# Altium schematic sheet DAC8554.SchDoc: FIT_PM12 board
size 420 x 297 mm; CheckedBy: G.Kasprowicz; Author: INR Moscow; CompanyName: WUT ISE; DrawnBy: M.Podgórski; Organization: WUT ISE; Address1: PW ISE; Address2: Nowowiejska 15/19 00-665 Warsaw; Address3: gkasprow@gmail.com; DocumentNumber: 8; Revision: 2; SheetNumber: 11; SheetTotal: 34; ModifiedBy: -; CheckedDate: -; Title2: DACs; DivGrp: WUT ISE; Designer: INR RAS; ModifiedDate: -; ProjectName: Sensor Box
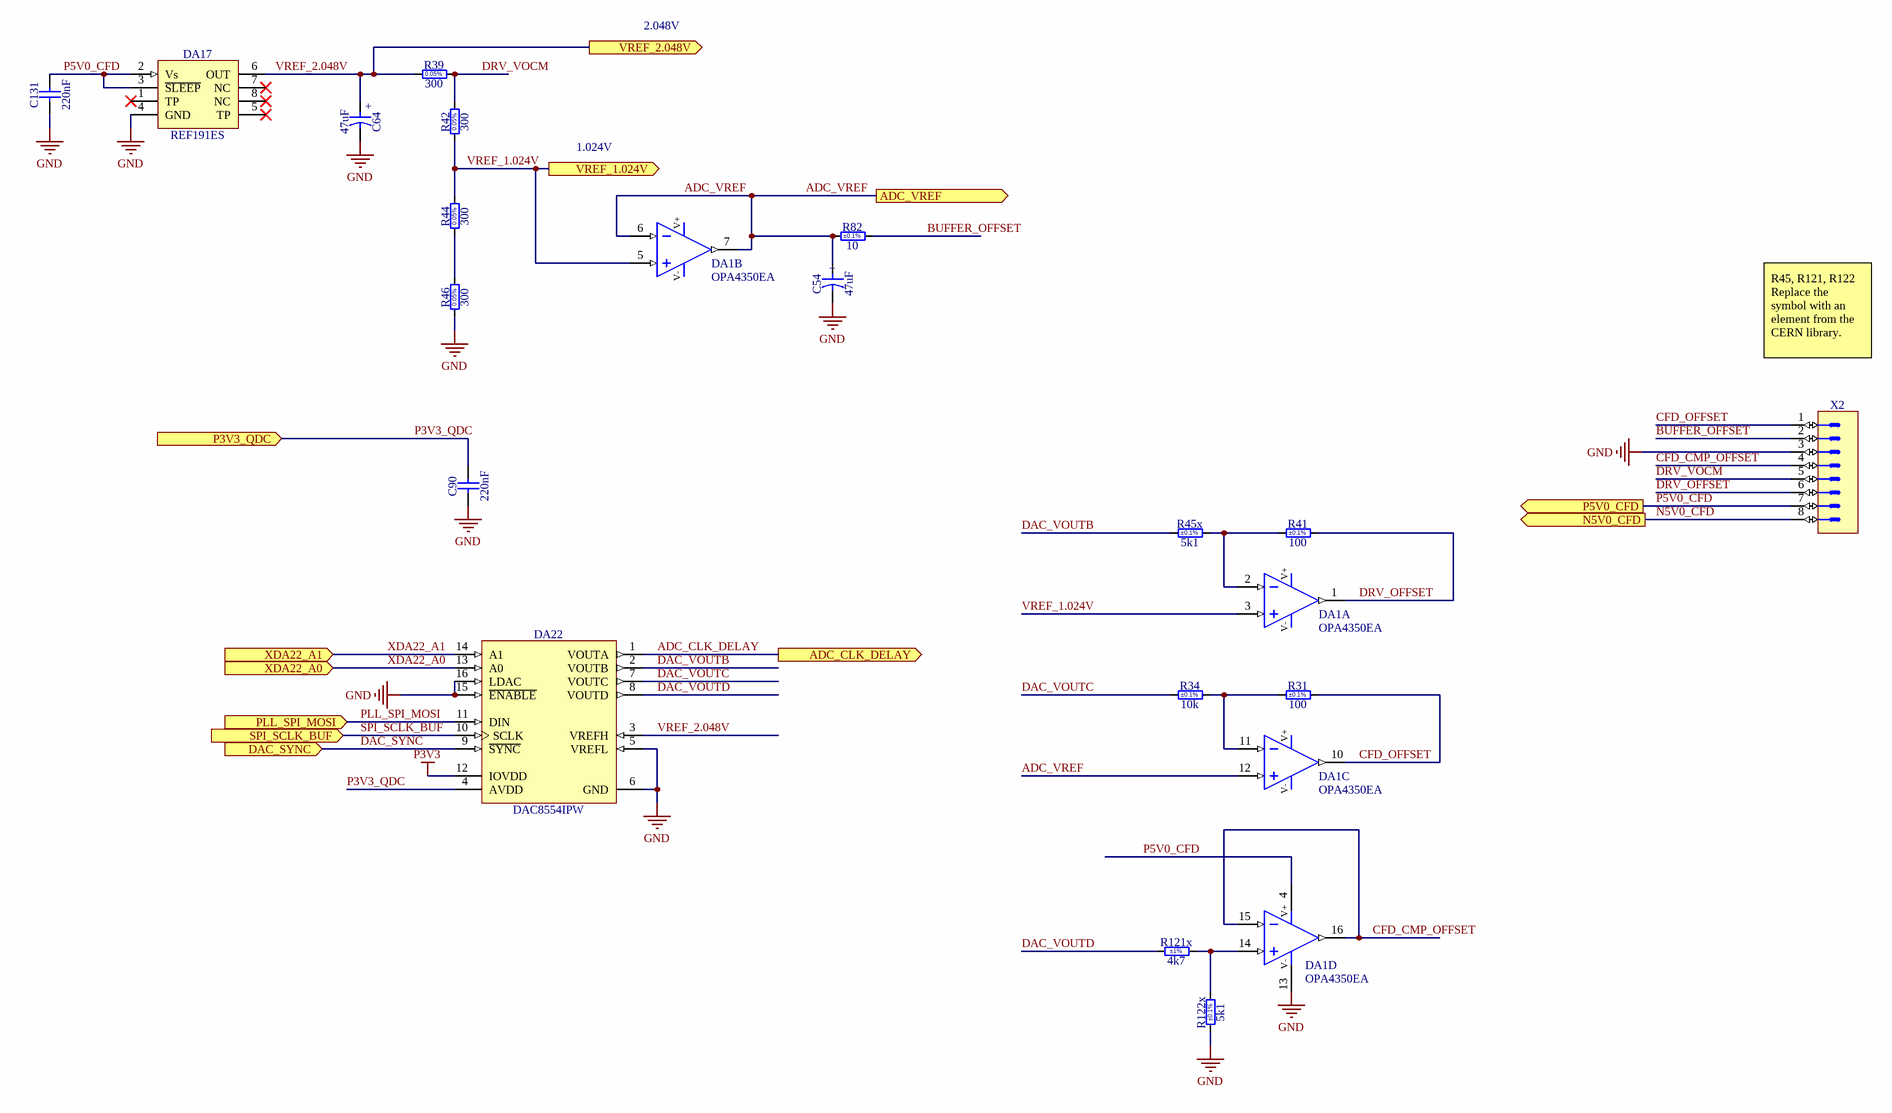
[diagram p0: DAC8554.SchDoc]

## Parts
C54  47uF  [CAPMP3528X120N]
C64  47uF  [CAPMP3528X120N]
C90  220nF  [CAPC2012X135N]
C131  220nF  [CAPC2012X135N]
DA1  OPA4350EA  [SOP63P600X175-16N]  (parts A,B,C,D of 4)
DA17  REF191ES  [SOIC127P600X175-8N]
DA22  DAC8554IPW  [SOP65P640X110-16N]
R31  100  Tolerance: ±0.1%  [RESC2012X60N]
R34  10k  Tolerance: ±0.1%  [RESC2012X60N]
R39  300  [RESC2012X60N]
R41  100  Tolerance: ±0.1%  [RESC2012X60N]
R42  300  [RESC2012X60N]
R44  300  [RESC2012X60N]
R45x  5k1  Tolerance: ±0.1%  [RESC2012X60N]
R46  300  [RESC2012X60N]
R82  10  Tolerance: ±0.1%  [RESC2012X60N]
R121x  4k7  Tolerance: ±1%  [RESC2012X60N]
R122x  5k1  Tolerance: ±0.1%  [RESC2012X60N]
X2  Header 8  [SAMTEC_DW-08-09-L-S-470]  (value not drawn)

## Ports
ADC_CLK_DELAY (out), ADC_VREF (out), DAC_SYNC (in), N5V0_CFD (out), P3V3_QDC (in), P5V0_CFD (out), PLL_SPI_MOSI (in), SPI_SCLK_BUF (in), VREF_1.024V (out), VREF_2.048V (out), XDA22_A0 (in), XDA22_A1 (in)

## Nets
GND: C54.2 C64.2 C90.1 C131.1 DA1.13(V-) DA17.4(GND) DA22.5(VREFL) DA22.6(GND) DA22.15(~{ENABLE}) DA22.16(LDAC) R46.1 R122x.1 X2.3
P3V3: DA22.12(IOVDD)
ADC_CLK_DELAY: DA22.1(VOUTA) ; port ADC_CLK_DELAY
ADC_VREF: C54.1 DA1.6(IN-) DA1.7(OUT) DA1.12(IN+) R82.2 ; port ADC_VREF
BUFFER_OFFSET: R82.1 X2.2
CFD_CMP_OFFSET: DA1.15(IN-) DA1.16(OUT) X2.4
CFD_OFFSET: DA1.10(OUT) R31.2 X2.1
DAC_SYNC: DA22.9(~{SYNC}) ; port DAC_SYNC
DAC_VOUTB: DA22.2(VOUTB) R45x.1
DAC_VOUTC: DA22.7(VOUTC) R34.1
DAC_VOUTD: DA22.8(VOUTD) R121x.1
DRV_OFFSET: DA1.1(OUT) R41.2 X2.6
DRV_VOCM: R39.2 R42.2 X2.5
N5V0_CFD: X2.8 ; port N5V0_CFD
P3V3_QDC: C90.2 DA22.4(AVDD) ; port P3V3_QDC
P5V0_CFD: C131.2 DA1.4(V+) DA17.2(Vs) DA17.3(~{SLEEP}) X2.7 ; port P5V0_CFD
PLL_SPI_MOSI: DA22.11(DIN) ; port PLL_SPI_MOSI
SPI_SCLK_BUF: DA22.10(SCLK) ; port SPI_SCLK_BUF
VREF_1.024V: DA1.3(IN+) DA1.5(IN+) R42.1 R44.2 ; port VREF_1.024V
VREF_2.048V: C64.1 DA17.6(OUT) DA22.3(VREFH) R39.1 ; port VREF_2.048V
XDA22_A0: DA22.13(A0) ; port XDA22_A0
XDA22_A1: DA22.14(A1) ; port XDA22_A1
NetDA1_2: DA1.2(IN-) R41.1 R45x.2
NetDA1_11: DA1.11(IN-) R31.1 R34.2
NetDA1_14: DA1.14(IN+) R121x.2 R122x.2
NetR44_1: R44.1 R46.2

Not connected (* = marked no-connect by the designer): DA17 1(TP)* 5(TP)* 7(NC)* 8(NC)*

## Notes on the sheet
- 2.048V
- 1.024V
- R45, R121, R122 Replace the symbol with an element from the CERN library.
- Project/Equipment
- Document
- Designer
- Drawn by
- Check.by
- Copyright WUT ISE 2024.
  This documentation describes Open Hardware and is licensed under the CERN OHL v.2. You may redistribute and modify this documentation under the terms of the CERN OHL v.2. (http://ohwr.org/CERNOHL). This documentation is distributed WITHOUT ANY EXPRESS OR IMPLIED WARRANTY, INCLUDING OF MERCHANTABILITY, SATISFACTORY QUALITY AND FITNESS FOR A PARTICULAR PURPOSE. Please see the CERN OHL v.2 for applicable conditions.
- Contact
- File
- Last Mod.
- Print Date
- Sheet
- Size
- A3
- of
- Rev
- (in symbol CTE3528-12_47UF_10V_20%_PANASONIC_TPG) +
- (in symbol R0805_300R_0.05%_0.125W_10PPM) 0.05%

## Library data of the parts
C54 C64 = CTE3528-12_47UF_10V_20%_PANASONIC_TPG: Polarised capacitor; Part Description: ESR 0R07 Solid Tantalum Chip Capacitor; Manufacturer Part Number: 10TPG47M; Voltage: 10V; Tolerance: ±20%; Part Number: CTE3528-12_47UF_10V_20%_PANASONIC_TPG; Component Kind: Standard; Component Type: Standard; Pin Count: 2; Value: 47uF; Status: None; Manufacturer: PANASONIC; Case: T; Mounted: Yes; Socket: No; SMD: Yes; Sense: No; ComponentHeight: 1.2mm; HelpURL: \\cern.ch\dfs\Applications\Altium\Datasheets\CTE_PANASONIC_TPG.pdf; Author: CERN DEM JLC; CreateDate: 01.09.2014; LatestRevisionDate: 01.09.2014
C90 C131 = CC0805_220NF_50V_10%_X7R: Non-polarised capacitor; Part Description: SMD Multilayer Chip Ceramic Capacitor; Manufacturer: GENERIC; Manufacturer1 Part Number: GRM21BR71H224KA01L; Voltage: 50V; TC: X7R; Tolerance: ±10%; Part Number: CC0805_220NF_50V_10%_X7R; Component Kind: Standard; Component Type: Standard; Pin Count: 2; Value: 220nF; Status: Preferred; Manufacturer Part Number: CC0805_220NF_50V_10%_X7R; Case: 0805; Mounted: Yes; Socket: No; SMD: Yes; Sense: No; Manufacturer1 Example: MURATA; Manufacturer1 ComponentHeight: 1.35mm; HelpURL: \\cern.ch\dfs\Applications\Altium\Datasheets\CC0805_X7R_MURATA.pdf; Author: CERN DEM JLC; CreateDate: 03.12.2007; LatestRevisionDate: 03.12.2007
DA1 = OPA4350EA: Quad Operational Amplifier; Part Description: Quad, High-Speed, Single-Supply, Rail-to-Rail Operational Amplifiers MicroAmplifier Series; Manufacturer: TEXAS INSTRUMENTS; PressFit: No; Bonding: No; Part Number: OPA4350EA; Component Kind: Standard; Component Type: Standard; Device: OPA4350EA; PackageDescription: SOP, 0.635mm Pitch; 16 Pin, 3.9mm W X 4.895mm L X 1.75mm H body, IPC Medium Density; Manufacturer Part Number: OPA4350EA; Pin Count: 16; Case: SSOP16; Mounted: Yes; Socket: No; SMD: Yes; Sense: No; ComponentHeight: 1.75mm; Author: CERN DEM HF; HelpURL: \\cern.ch\dfs\Applications\Altium\Datasheets\OPA4350EA.pdf; CreateDate: 08.05.2024; LatestRevisionDate: 08.05.2024
DA17 = REF191ES: Precision Micropower, Low Dropout Voltage Reference; Part Description: 2.048V Precision Micropower, Low Dropout Voltage Reference, 5ppm/°C, −40°C to +85°C; Manufacturer: ANALOG DEVICES; PressFit: No; Bonding: No; Part Number: REF191ES; Component Kind: Standard; Component Type: Standard; Device: REF191ES; PackageDescription: SOIC 8, Pitch 1.27mm, Body 4x5mm, IPC Medium Density; Manufacturer Part Number: REF191ES; Pin Count: 8; Case: SOIC8; Mounted: Yes; Socket: No; SMD: Yes; Sense: No; ComponentHeight: 1.75mm; HelpURL: \\cern.ch\dfs\Applications\Altium\Datasheets\REF19x_Series.pdf; Author: CERN DEM HF; CreateDate: 17.05.2024; LatestRevisionDate: 17.05.2024
DA22 = DAC8554IPW: 16-Bit, Quad-Channel, Uultra-Low Glitch, Voltage Output Digital-to-Analog Converter; Manufacturer: TEXAS INSTRUMENTS; PressFit: No; Bonding: No; Part Number: DAC8554IPW; Component Kind: Standard; Component Type: Standard; Device: DAC8554IPW; PackageDescription: SOP, 0.65mm Pitch; 16 Pin, 4.40mm W X 5.00mm L X 1.10mm H body, IPC Medium Density; Part Description: 16-Bit, Quad-Channel, Uultra-Low Glitch, Voltage Output Digital-to-Analog Converter; Manufacturer Part Number: DAC8554IPW; Pin Count: 16; Case: TSSOP16; Mounted: Yes; Socket: No; SMD: Yes; Sense: No; ComponentHeight: 1.1mm; Author: CERN DEM HF; HelpURL: \\cern.ch\dfs\Applications\Altium\Datasheets\DAC8554.pdf; CreateDate: 07.05.2024; LatestRevisionDate: 07.05.2024
R31 R41 = R0805_100R_0.1%_0.1W_10PPM: Resistor - 0.1%; Part Description: Thin Film Chip Resistor; Manufacturer: GENERIC; Manufacturer1 Part Number: RN73C2A100RBTG; Power: 0.1W; TC: ±10ppm; PressFit: No; Part Number: R0805_100R_0.1%_0.1W_10PPM; Component Kind: Standard; Component Type: Standard; Pin Count: 2; Value: 100; Status: Not Recommended; Manufacturer Part Number: R0805_100R_0.1%_0.1W_10PPM; Case: 0805; Mounted: Yes; Sense: No; Socket: No; SMD: Yes; Manufacturer1 Example: TYCO HOLSWORTHY; Manufacturer1 ComponentHeight: 0.6mm; HelpURL: \\cern.ch\dfs\Applications\Altium\Datasheets\R0805_Tyco_RN73.pdf; Author: CERN DEM JLC; CreateDate: 03.12.2007; LatestRevisionDate: 13.03.2008
R34 = R0805_10K_0.1%_0.1W_10PPM: Resistor - 0.1%; Part Description: Thin Film Chip Resistor; Manufacturer: GENERIC; Manufacturer1 Part Number: RN73C2A10KBTG; Power: 0.1W; TC: ±10ppm; PressFit: No; Part Number: R0805_10K_0.1%_0.1W_10PPM; Component Kind: Standard; Component Type: Standard; Pin Count: 2; Value: 10k; Status: Not Recommended; Manufacturer Part Number: R0805_10K_0.1%_0.1W_10PPM; Case: 0805; Mounted: Yes; Sense: No; Socket: No; SMD: Yes; Manufacturer1 Example: TYCO HOLSWORTHY; Manufacturer1 ComponentHeight: 0.6mm; HelpURL: \\cern.ch\dfs\Applications\Altium\Datasheets\R0805_Tyco_RN73.pdf; Author: CERN DEM JLC; CreateDate: 03.12.2007; LatestRevisionDate: 13.03.2008
R39 R42 R44 R46 = R0805_300R_0.05%_0.125W_10PPM: Resistor - 0.05%; Part Description: Thin Film Chip Resistor; Manufacturer: GENERIC; Manufacturer1 Part Number: RG2012N-301-W; Power: 0.125W; TC: ±10ppm/°C; PressFit: No; Part Number: R0805_300R_0.05%_0.125W_10PPM; Component Kind: Standard; Component Type: Standard; Pin Count: 2; Value: 300; Status: Not Recommended; Tolerance: ±0.05%; Manufacturer Part Number: R0805_300R_0.05%_0.125W_10PPM; Case: 0805; Mounted: Yes; Sense: No; Socket: No; SMD: Yes; Manufacturer1 Example: SUSUMU; Manufacturer1 ComponentHeight: 0.5mm; HelpURL: \\cern.ch\dfs\Applications\Altium\Datasheets\R0805_SUSUMU_RG.pdf; Author: CERN DEM HF; CreateDate: 24.06.2024; LatestRevisionDate: 24.06.2024
R45x R122x = R0805_5K1_0.1%_0.1W_25PPM: Resistor - 0.1%; Part Description: Precision Surface Mount Resistor; Manufacturer: GENERIC; Manufacturer1 Part Number: PCF0805R-5K1BT1; Power: 0.1W; TC: ±25ppm/°C; PressFit: No; Part Number: R0805_5K1_0.1%_0.1W_25PPM; Component Kind: Standard; Component Type: Standard; Pin Count: 2; Value: 5k1; Status: Not Recommended; Manufacturer Part Number: R0805_5K1_0.1%_0.1W_25PPM; Case: 0805; Mounted: Yes; Sense: No; Socket: No; SMD: Yes; Manufacturer1 Example: TT ELECTRONICS; Manufacturer1 ComponentHeight: 0.5mm; HelpURL: \\cern.ch\dfs\Applications\Altium\Datasheets\R0805_TT ELECTRONICS_PCF.pdf; Author: CERN DEM JLC; CreateDate: 03.11.2010; LatestRevisionDate: 25.10.2018
R82 = R0805_10R_0.1%_0.1W_10PPM: Resistor - 0.1%; Part Description: Thin Film Chip Resistor; Manufacturer: GENERIC; Manufacturer1 Part Number: RN73C2A10RBTG; Power: 0.1W; TC: ±10ppm; PressFit: No; Part Number: R0805_10R_0.1%_0.1W_10PPM; Component Kind: Standard; Component Type: Standard; Pin Count: 2; Value: 10; Status: Not Recommended; Manufacturer Part Number: R0805_10R_0.1%_0.1W_10PPM; Case: 0805; Mounted: Yes; Sense: No; Socket: No; SMD: Yes; Manufacturer1 Example: TYCO HOLSWORTHY; Manufacturer1 ComponentHeight: 0.6mm; HelpURL: \\cern.ch\dfs\Applications\Altium\Datasheets\R0805_Tyco_RN73.pdf; Author: CERN DEM JLC; CreateDate: 03.12.2007; LatestRevisionDate: 13.03.2008
R121x = R0805_4K7_1%_0.125W_100PPM: Resistor - 1%; Part Description: General Purpose Thick Film Chip Resistor; Manufacturer: GENERIC; Manufacturer1 Part Number: NRC10F4701TRF; Power: 0.125W; TC: ±100ppm/°C; PressFit: No; Part Number: R0805_4K7_1%_0.125W_100PPM; Component Kind: Standard; Component Type: Standard; Pin Count: 2; Value: 4k7; Status: Preferred; Manufacturer Part Number: R0805_4K7_1%_0.125W_100PPM; Case: 0805; Mounted: Yes; Sense: No; Socket: No; SMD: Yes; Manufacturer1 Example: NIC COMPONENT; Manufacturer1 ComponentHeight: 0.6mm; HelpURL: \\cern.ch\dfs\Applications\Altium\Datasheets\R0805_NIC_NRC.pdf; Author: CERN DEM JLC; CreateDate: 03.12.2007; LatestRevisionDate: 13.03.2008
X2 = SAMTEC_DW-08-09-L-S-470: Connector 8 Male; Part Description: 8 Contacts, Pitch 2.54mm, Single Row Straight .Flex Stack, Flexible Board Stacker (Stacker Height = 11,938mm); Manufacturer: SAMTEC; PressFit: No; Part Number: SAMTEC_DW-08-09-L-S-470; Component Kind: Standard; Component Type: Standard; Pin Count: 8; Family: Header 8; Mounted: Yes; Socket: No; SMD: No; Sense: No; Status: None; Manufacturer Part Number: DW-08-09-L-S-470; ComponentHeight: 15.75mm; HelpURL: \\cern.ch\dfs\Applications\Altium\Datasheets\SAMTEC_DW.pdf; Author: CERN DEM HF; CreateDate: 06.06.2024; LatestRevisionDate: 06.06.2024